# EAGLE schematic 000002 XXX Rev 1.00 (EAGLE 9.6.2)
DATE: 25.2.2018; OWNER: Kallio Designs; PCBA_PN: XXXXXX; PCB_PN: XXXXXX; REVISION: 1.0; TITLE: Modify global attributes; Z_SHEET2: Sheet 2; Z_SHEET3: Sheet 3; Z_SHEET4: Sheet 4; Z_SHEET5: Sheet 5; Z_SHEET6: Sheet 6; Z_SHEET7: Sheet 7; Z_SHEET8: Sheet 8
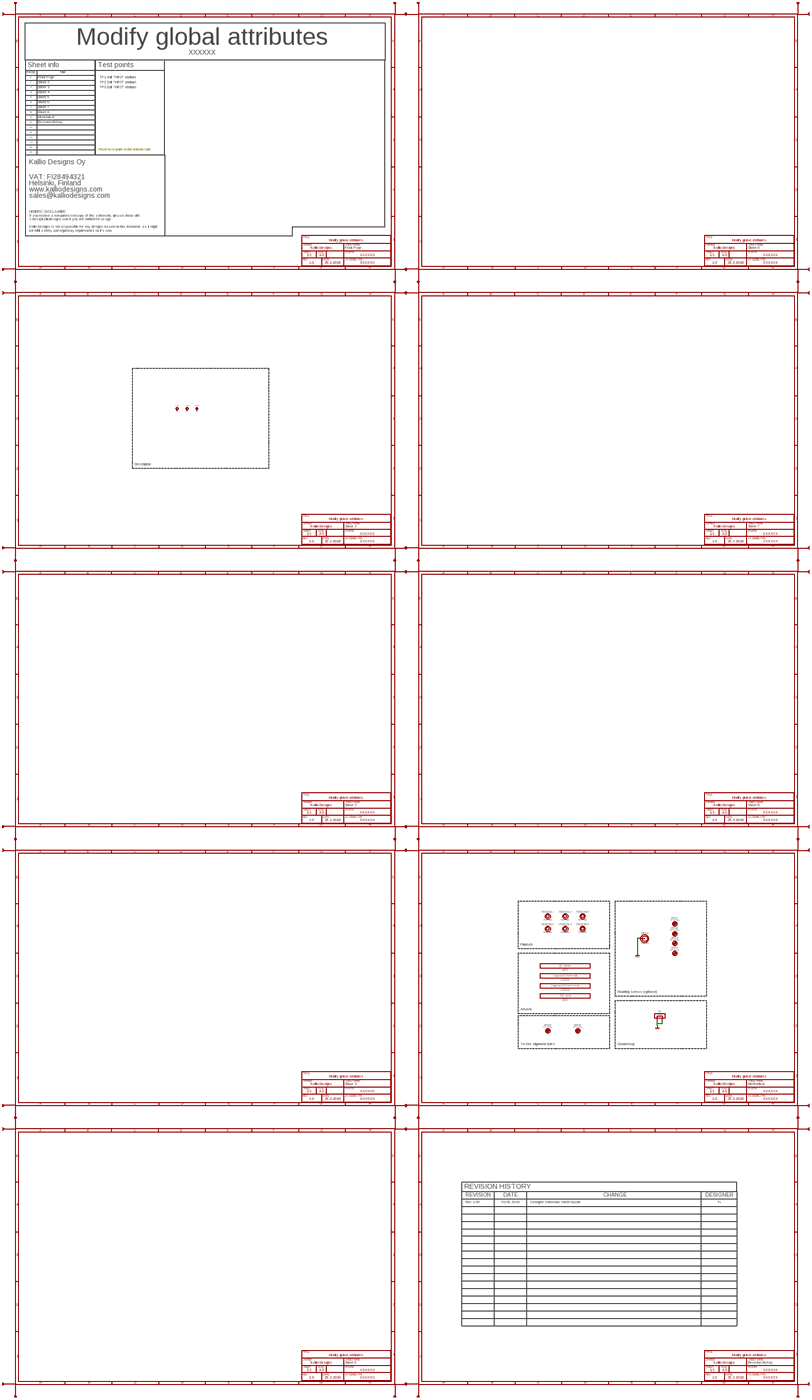
[diagram p0: schematic, sheet 1, overview]
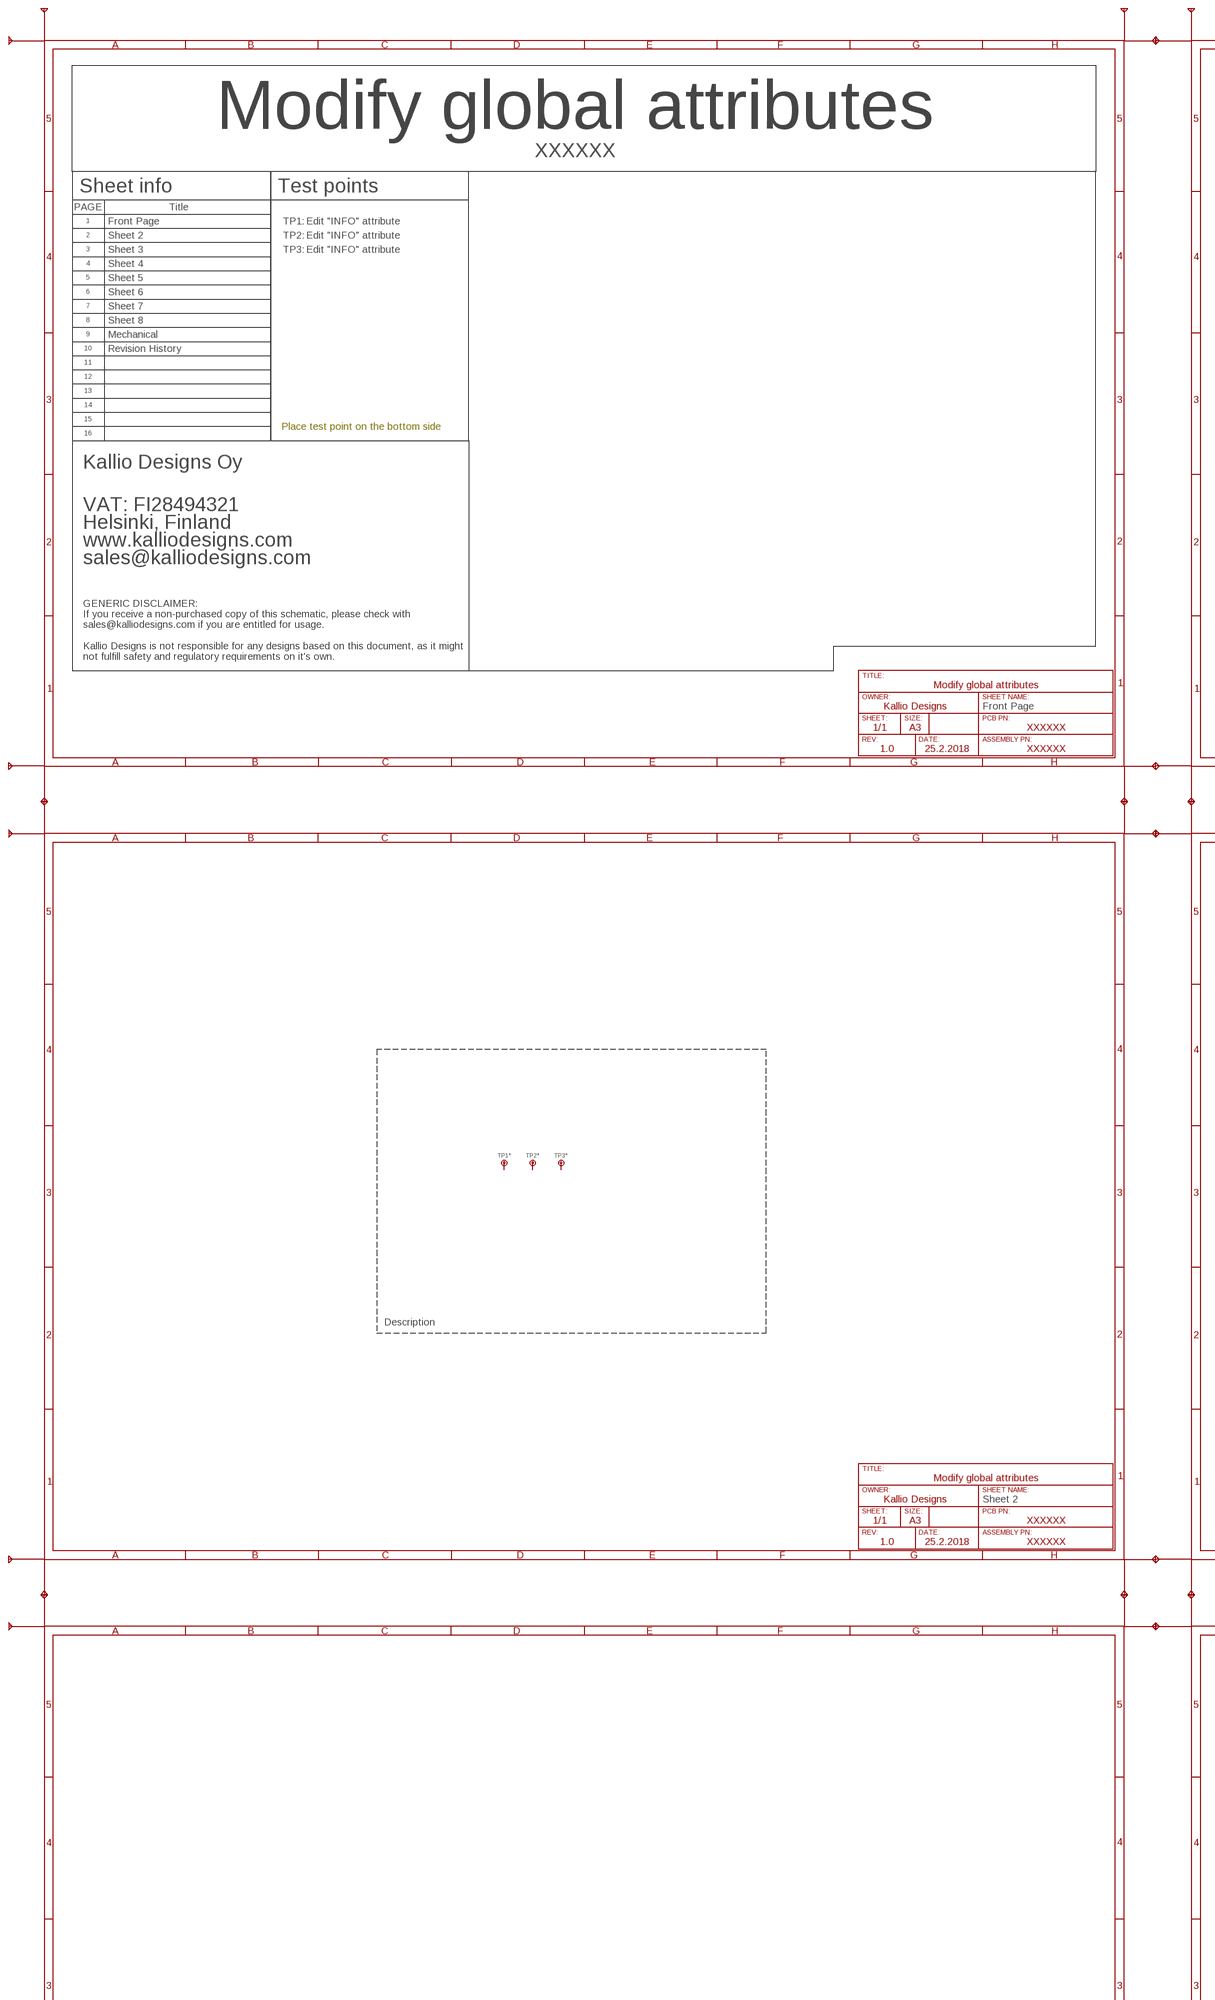
[diagram p1: schematic, sheet 1, part 1 of 4]
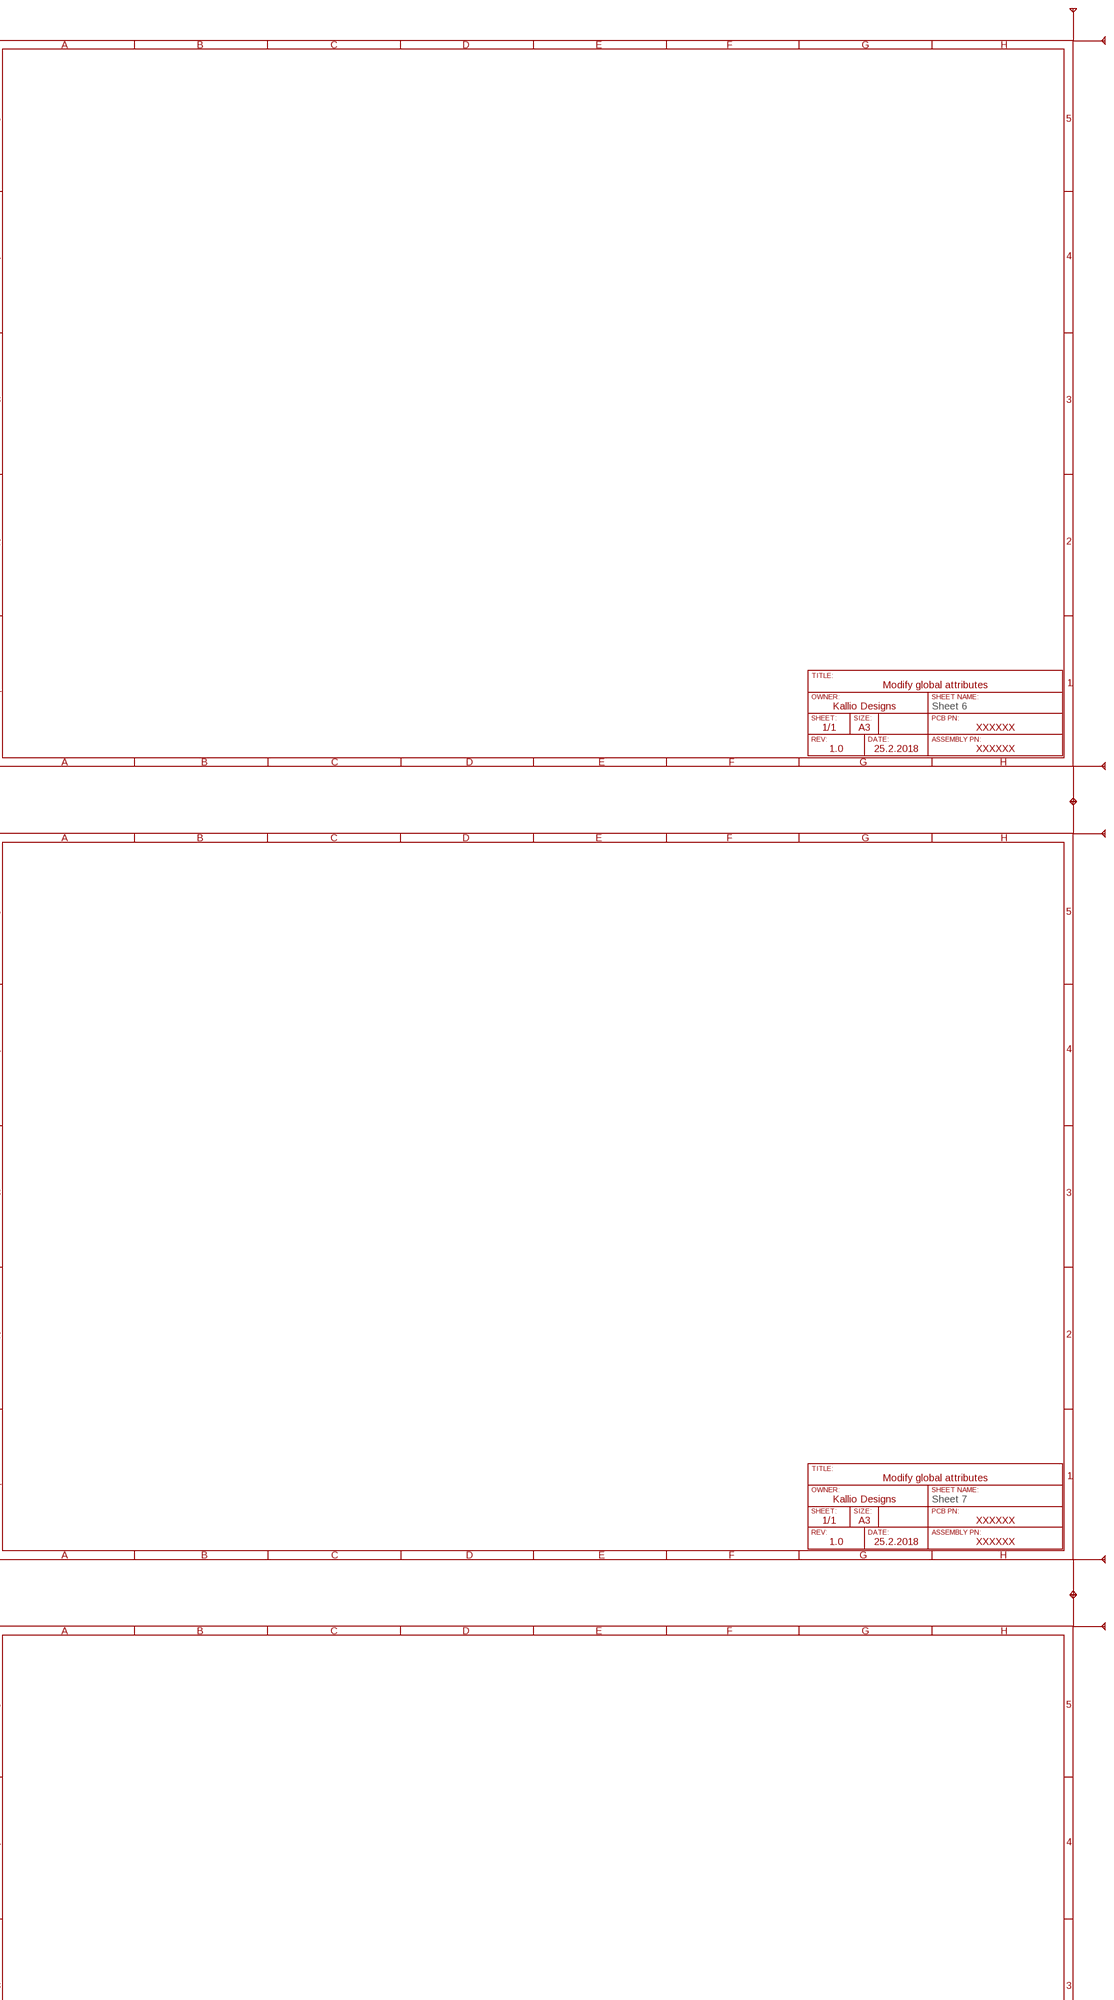
[diagram p2: schematic, sheet 1, part 2 of 4]
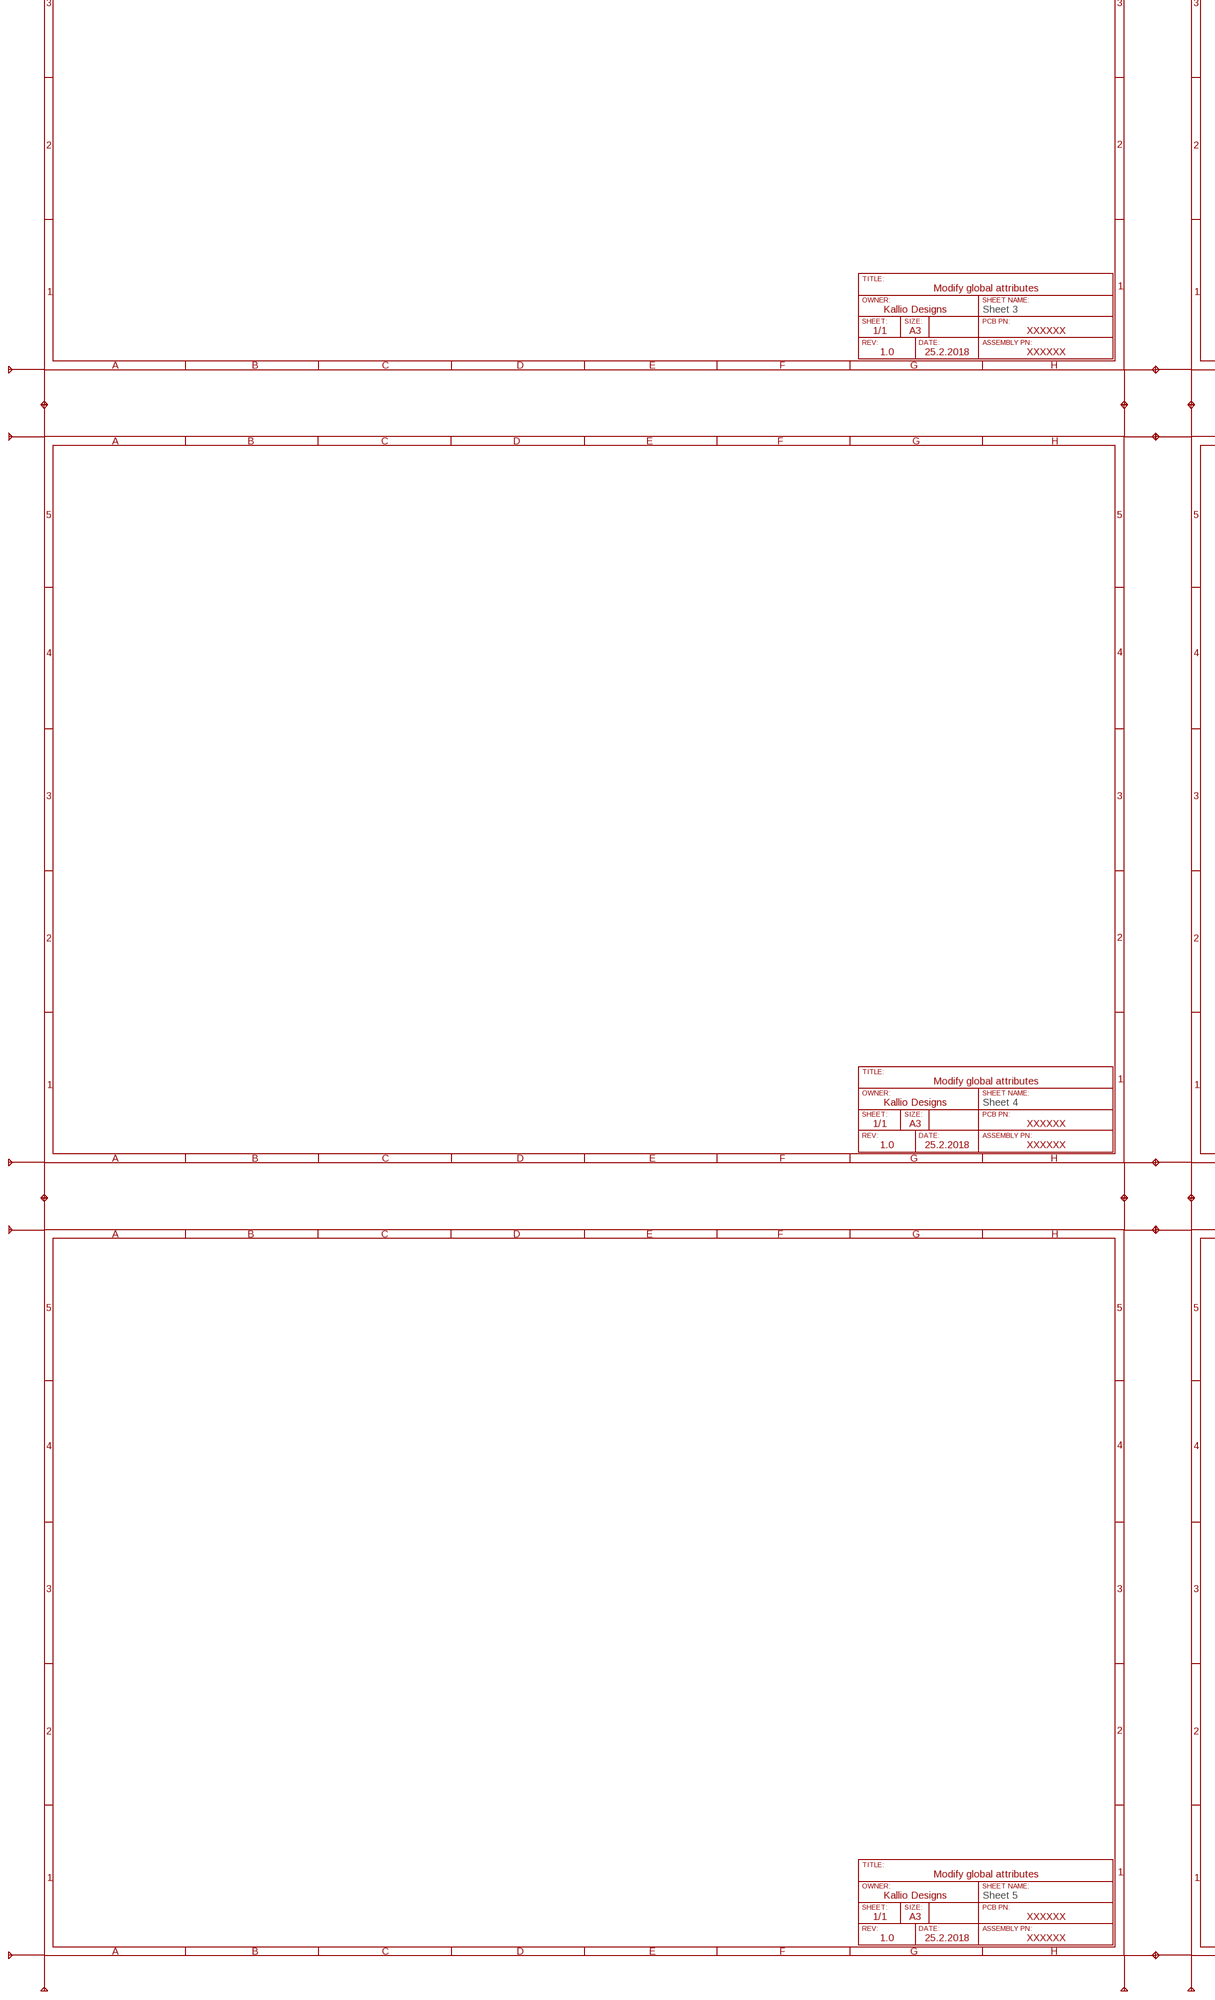
[diagram p3: schematic, sheet 1, part 3 of 4]
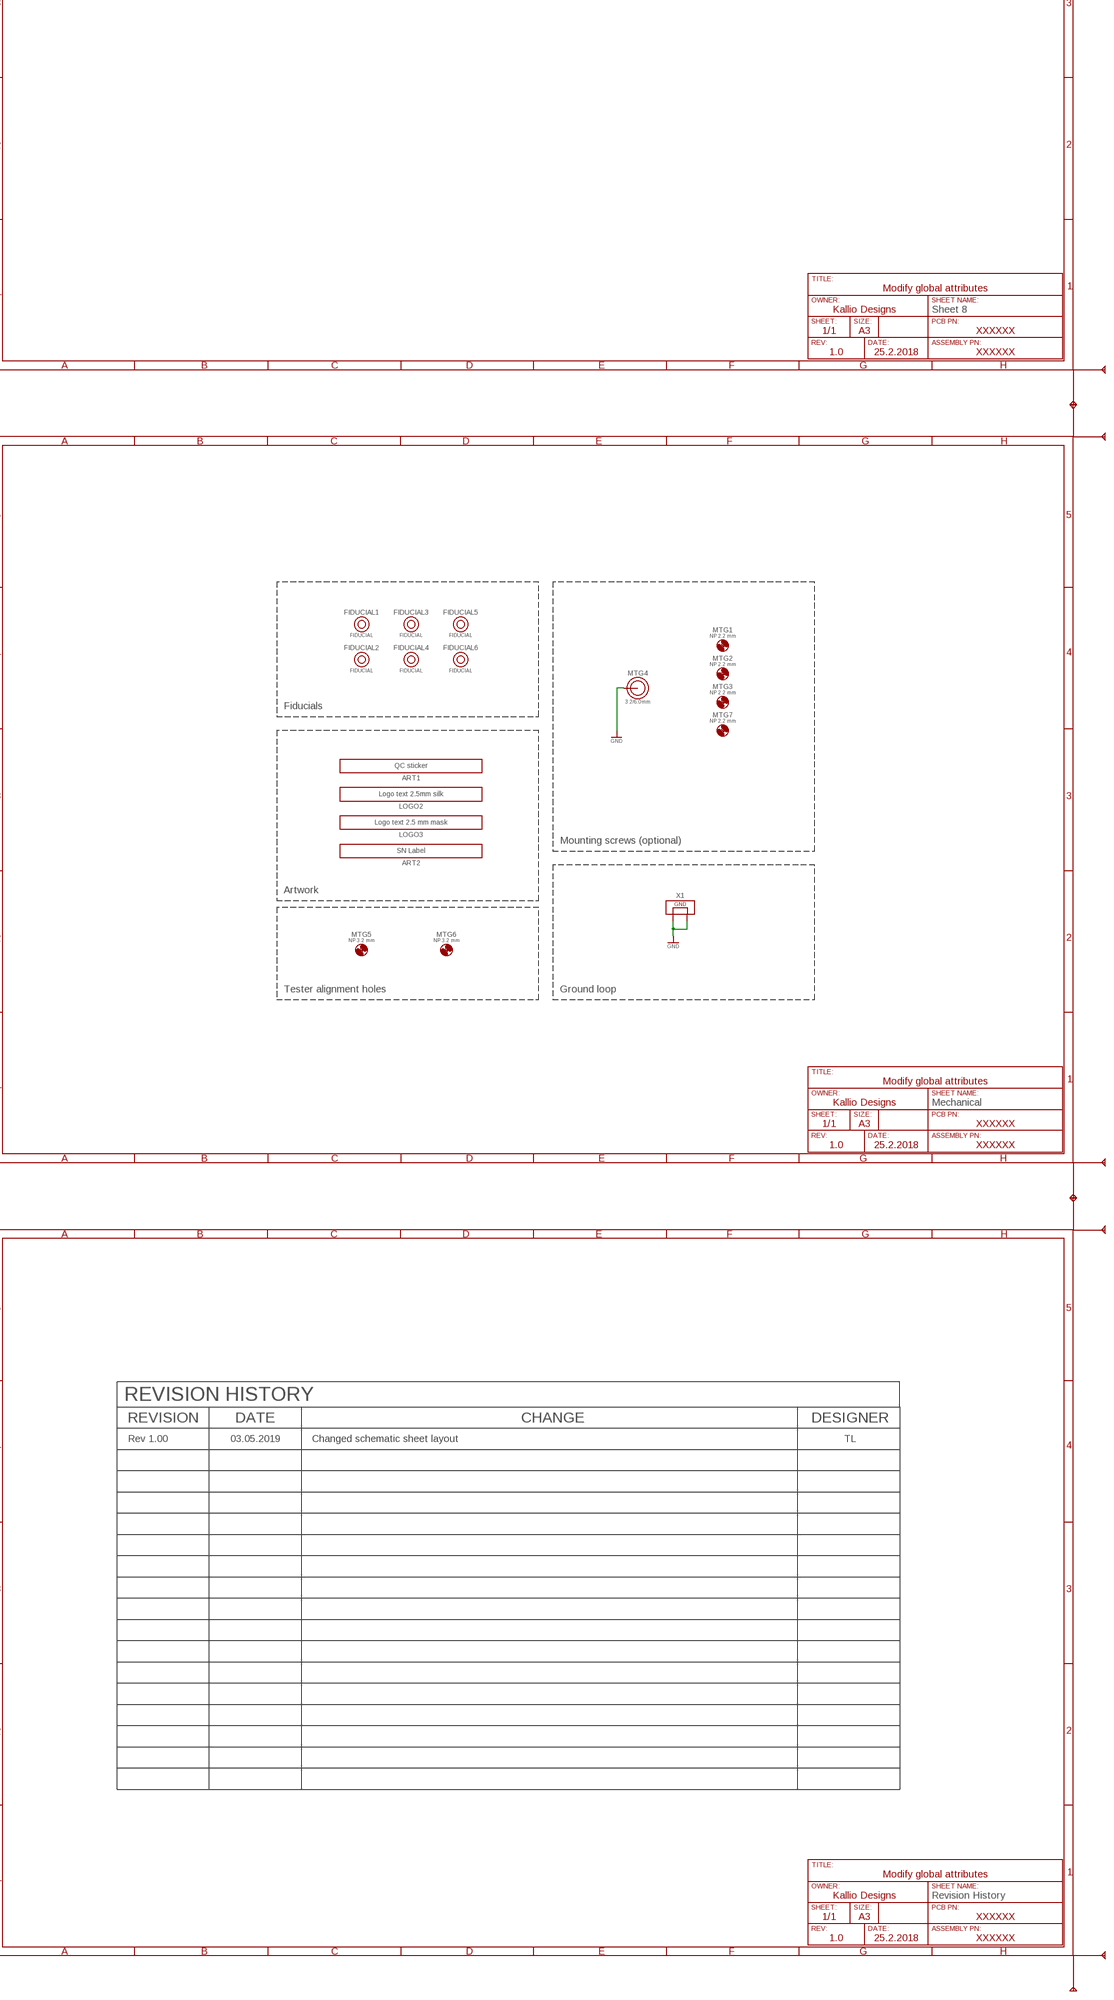
[diagram p4: schematic, sheet 1, part 4 of 4]
REVINFO1 (ART_REVISION_HISTORY): CODE: DNP; DNP: T; MANUFACTURER: DNP; MFG_PARTNO: DNP; PRICE: 0; SUPPLIER: DNP; SUPPLIER_PARTNO: DNP
SHEETINFO1 (ART_SHEET_INFO_1-16): CODE: DNP; DNP: T; MANUFACTURER: DNP; MFG_PARTNO: DNP; PRICE: 0; SUPPLIER: DNP; SUPPLIER_PARTNO: DNP
TEST_POINTS1 (ART_TEST_POINTS): CODE: DNP; DNP: T; MANUFACTURER: DNP; MFG_PARTNO: DNP; PRICE: 0; SUPPLIER: DNP; SUPPLIER_PARTNO: DNP

## Parts
ART1  ART_QC  [ART_QC_BIG]
ART2  ART_SN_LABEL-08X24  [ART_SN_8X24]
FIDUCIAL1  FIDUCIAL  [FIDUCIAL]
FIDUCIAL2  FIDUCIAL  [FIDUCIAL]
FIDUCIAL3  FIDUCIAL  [FIDUCIAL]
FIDUCIAL4  FIDUCIAL  [FIDUCIAL]
FIDUCIAL5  FIDUCIAL  [FIDUCIAL]
FIDUCIAL6  FIDUCIAL  [FIDUCIAL]
LOGO2  ART_LOGO_TEXT_2.5MM-SILK  [ART_LOGO_TEXT_2.5MM_SILK]
LOGO3  ART_LOGO_TEXT_2.5MM-MASK  [ART_LOGO_TEXT_2.5MM_MASK]
MTG1  HOL_2.2/4.2_NP  [MTG_NP_M2_220X420]
MTG2  HOL_2.2/4.2_NP  [MTG_NP_M2_220X420]
MTG3  HOL_2.2/4.2_NP  [MTG_NP_M2_220X420]
MTG4  HOL_3.2/6.0_PTH-3.2/6.0_PTH  [MTG_PTH_M3_320X600]
MTG5  HOL_3.2/6.0_NP-NOSILK  [MTG_NP_M3_320X600_NOSILK]
MTG6  HOL_3.2/6.0_NP-NOSILK  [MTG_NP_M3_320X600_NOSILK]
MTG7  HOL_2.2/4.2_NP  [MTG_NP_M2_220X420]
TP1  PAD_TEST_POINT-2.5MM  [TEST_POINT_2.5MM]
TP2  PAD_TEST_POINT-2.5MM  [TEST_POINT_2.5MM]
TP3  PAD_TEST_POINT-2.5MM  [TEST_POINT_2.5MM]
X1  PAD_TEST_GROUND_HOOK  [PAD_GND_HOOK_M]

## Nets
GND [100V/1A]: MTG4.1 X1.P$1 X1.P$2
Unconnected: TP1.P$1 TP2.P$1 TP3.P$1

## Notes on the sheet
- Front Page
- Mechanical
- Revision History
- Place test point on the bottom side
- Kallio Designs Oy
- VAT: FI28494321
- Helsinki, Finland
- www.kalliodesigns.com
- sales@kalliodesigns.com
- GENERIC DISCLAIMER:
  If you receive a non-purchased copy of this schematic, please check with
  sales@kalliodesigns.com if you are entitled for usage.
  
  Kallio Designs is not responsible for any designs based on this document, as it might
  not fulfill safety and regulatory requirements on it's own.
- Front Page
- Description
- Fiducials
- Mounting screws (optional)
- Artwork
- Tester alignment holes | Ground loop
- Mechanical
- Rev 1.00 | 03.05.2019 | Changed schematic sheet layout | TL
- Revision History

## Library data of the parts
ART1 = Custom_Eagle_KD:ART_QC: Placeholder for quality control sticker; CODE: QC sticker; DNP: T; MANUFACTURER: DNP; MFG_PARTNO: DNP; PRICE: 0; SUPPLIER: Digi-Key; SUPPLIER_PARTNO: DNP
ART2 = Custom_Eagle_KD:ART_SN_LABEL: Placeholder for serial number sticker; CODE: SN Label; DNP: T; MANUFACTURER: DNP; MFG_PARTNO: DNP; PRICE: 0; SUPPLIER: Digi-Key; SUPPLIER_PARTNO: DNP
FIDUCIAL1-FIDUCIAL6 = Custom_Eagle_KD:FIDUCIAL; CODE: FIDUCIAL; DNP: T; MANUFACTURER: DNP; MFG_PARTNO: DNP; SUPPLIER: DNP; SUPPLIER_PARTNO: DNP
LOGO2 = Custom_Eagle_KD:ART_LOGO_TEXT_2.5MM; CODE: Logo text 2.5mm silk; DNP: T; MANUFACTURER: DNP; MFG_PARTNO: DNP; PRICE: 0; SUPPLIER: DNP; SUPPLIER_PARTNO: DNP
LOGO3 = Custom_Eagle_KD:ART_LOGO_TEXT_2.5MM; CODE: Logo text 2.5 mm mask; DNP: T; MANUFACTURER: DNP; MFG_PARTNO: DNP; PRICE: 0; SUPPLIER: DNP; SUPPLIER_PARTNO: DNP
MTG1-MTG3 MTG7 = Custom_Eagle_KD:HOL_2.2/4.2_NP: Non-plated mounting hole; CODE: NP 2.2 mm; DNP: T; MANUFACTURER: DNP; MFG_PARTNO: DNP; PRICE: DNP; SUPPLIER: DNP; SUPPLIER_PARTNO: DNP
MTG4 = Custom_Eagle_KD:HOL_3.2/6.0_PTH; CODE: 3.2/6.0mm; DNP: T; MANUFACTURER: DNP; MFG_PARTNO: DNP; SUPPLIER: DNP; SUPPLIER_PARTNO: DNP
MTG5 MTG6 = Custom_Eagle_KD:HOL_3.2/6.0_NP: Non-plated mounting hole; CODE: NP 3.2 mm; DNP: T; MANUFACTURER: DNP; MFG_PARTNO: DNP; PRICE: DNP; SUPPLIER: DNP; SUPPLIER_PARTNO: DNP
TP1-TP3 = Custom_Eagle_KD:PAD_TEST_POINT: Test point. Not populated; CODE: DNP; DNP: T; INFO: Edit "INFO" attribute; MANUFACTURER: Do not populate; MFG_PARTNO: DNP; SUPPLIER: DNP; SUPPLIER_PARTNO: DNP
X1 = Custom_Eagle_KD:PAD_TEST_GROUND_HOOK; CODE: DNP; DNP: T; MANUFACTURER: Do not populate; MFG_PARTNO: DNP; PRICE: 0; SUPPLIER: DNP; SUPPLIER_PARTNO: DNP

## Net classes
1 100V/1A: width 0.5 mm, drill 0.9 mm
2 Analog: clearance 0.25 mm
3 Serial: clearance 0.25 mm